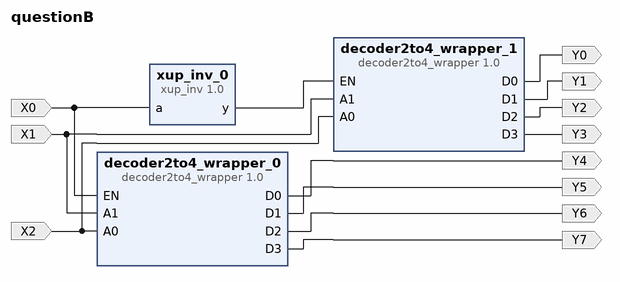
[diagram p0: block diagram of the top level]
# Vivado block design questionB, xc7k70tfbv676-1, Vivado 2020.1
create_bd_design questionB

create_bd_port -dir I X0
create_bd_port -dir I X1
create_bd_port -dir I X2
create_bd_port -dir O Y7
create_bd_port -dir O Y6
create_bd_port -dir O Y5
create_bd_port -dir O Y4
create_bd_port -dir O Y3
create_bd_port -dir O Y2
create_bd_port -dir O Y1
create_bd_port -dir O Y0

create_bd_cell -type ip -vlnv xilinx.com:user:decoder2to4_wrapper:1.0 decoder2to4_wrapper_0
create_bd_cell -type ip -vlnv xilinx.com:user:decoder2to4_wrapper:1.0 decoder2to4_wrapper_1
create_bd_cell -type ip -vlnv xilinx.com:XUP:xup_inv:1.0 xup_inv_0

# ---- connections ----

connect_bd_net [get_bd_pins decoder2to4_wrapper_1/D0] [get_bd_ports Y0]
connect_bd_net [get_bd_pins decoder2to4_wrapper_1/D1] [get_bd_ports Y1]
connect_bd_net [get_bd_pins decoder2to4_wrapper_1/D2] [get_bd_ports Y2]
connect_bd_net [get_bd_pins decoder2to4_wrapper_1/D3] [get_bd_ports Y3]
connect_bd_net [get_bd_pins decoder2to4_wrapper_0/D0] [get_bd_ports Y4]
connect_bd_net [get_bd_pins decoder2to4_wrapper_0/D1] [get_bd_ports Y5]
connect_bd_net [get_bd_pins decoder2to4_wrapper_0/D2] [get_bd_ports Y6]
connect_bd_net [get_bd_pins decoder2to4_wrapper_0/D3] [get_bd_ports Y7]
connect_bd_net -net X0_1 [get_bd_ports X0] [get_bd_pins xup_inv_0/a] [get_bd_pins decoder2to4_wrapper_0/EN]
connect_bd_net [get_bd_pins xup_inv_0/y] [get_bd_pins decoder2to4_wrapper_1/EN]
connect_bd_net -net X1_1 [get_bd_ports X1] [get_bd_pins decoder2to4_wrapper_1/A1] [get_bd_pins decoder2to4_wrapper_0/A1]
connect_bd_net -net X2_1 [get_bd_ports X2] [get_bd_pins decoder2to4_wrapper_1/A0] [get_bd_pins decoder2to4_wrapper_0/A0]

validate_bd_design
save_bd_design
